# EAGLE design ModelPłytki (EAGLE 9.5.2)
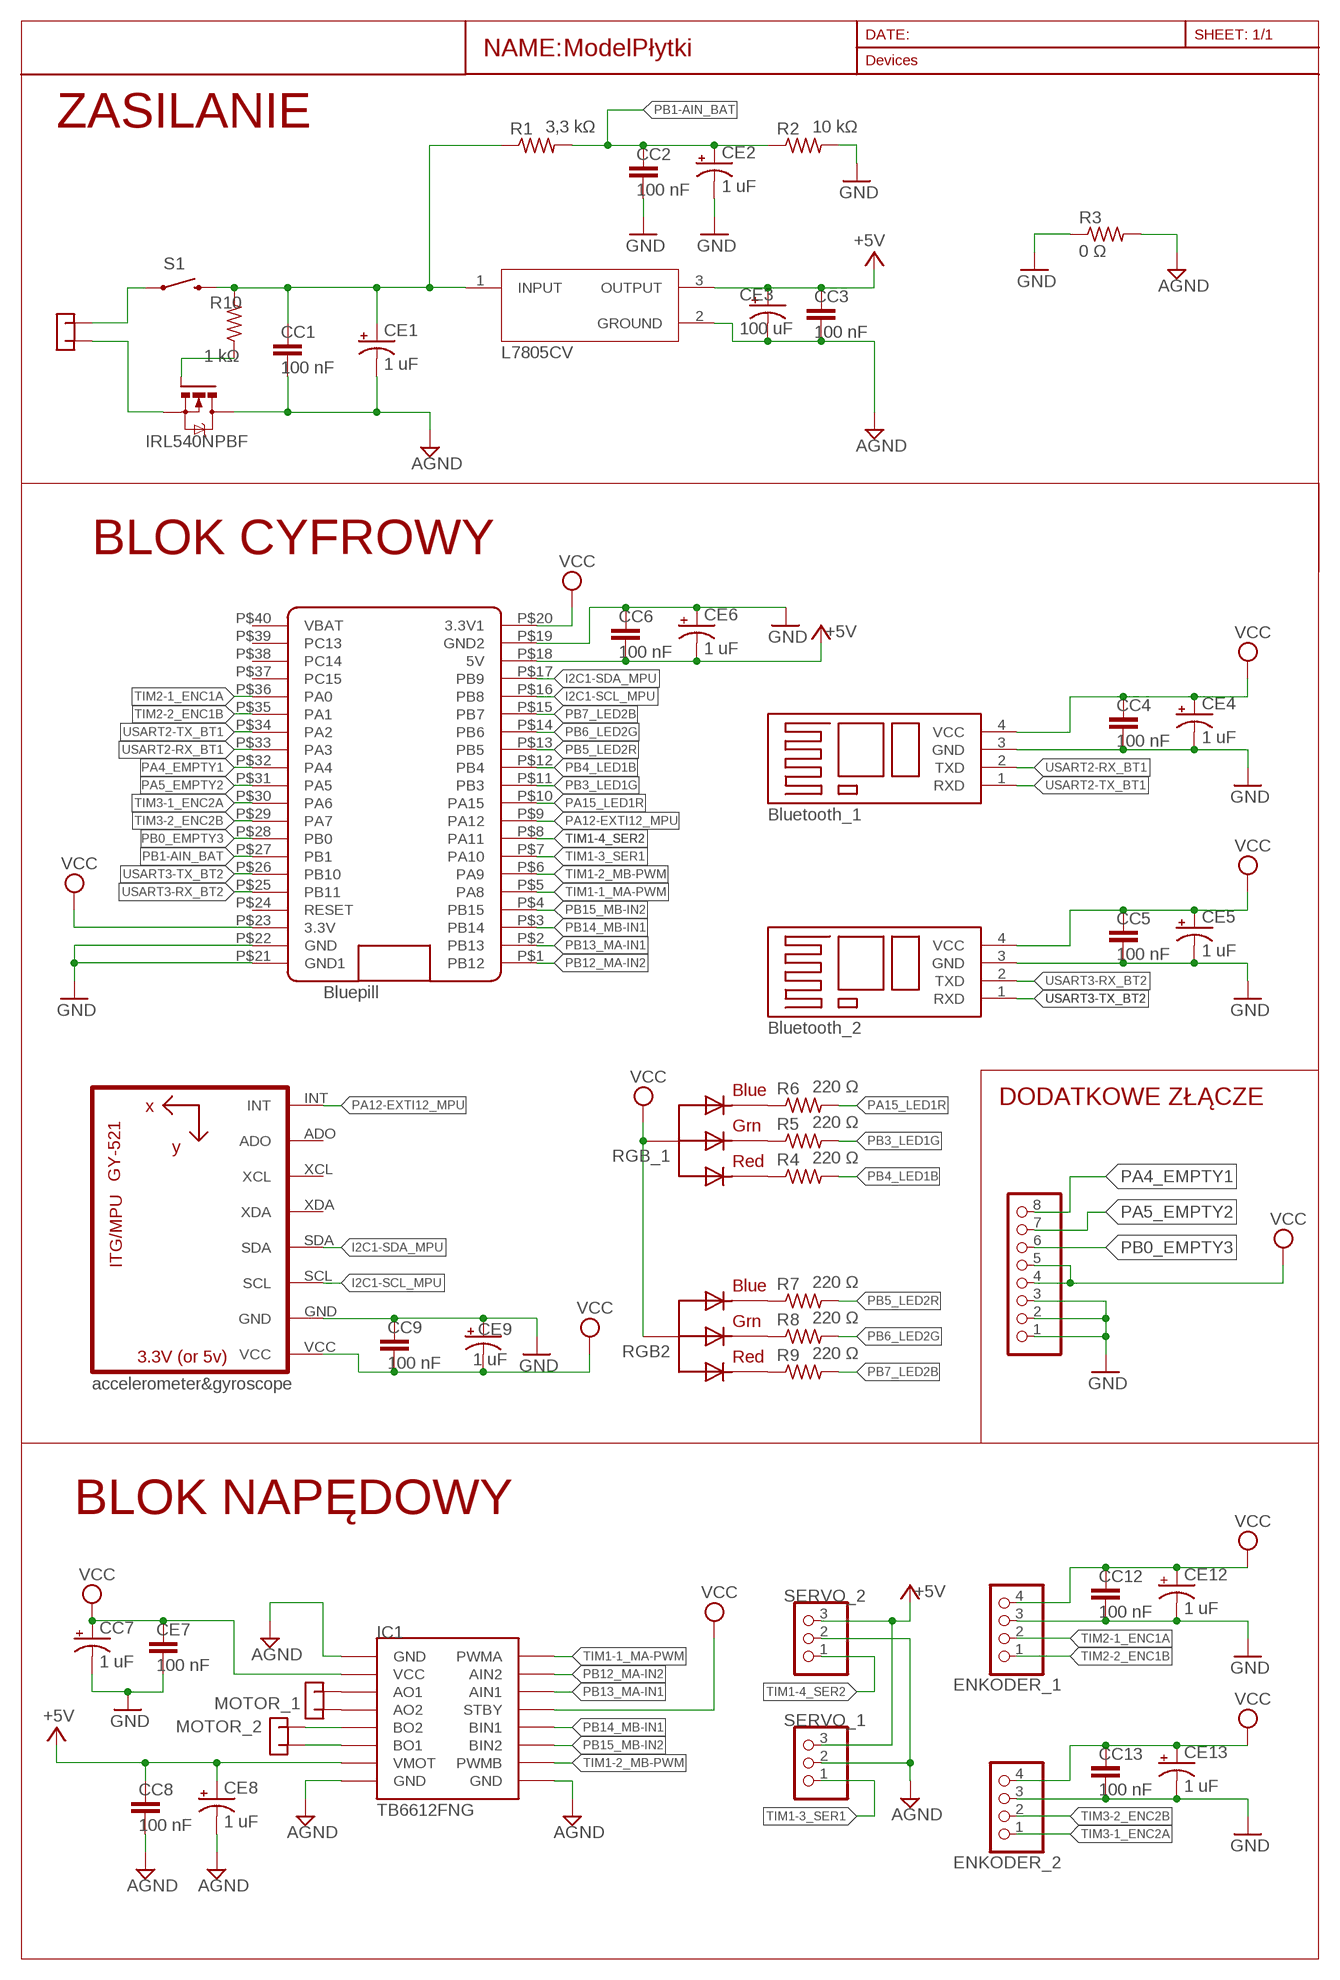
[diagram p0: schematic, sheet 1]

## Parts
BATERIA  -CON2  [CON2]
BLUETOOTH2  BLUETOOTH  [BLUETOOTH]
BLUETOOTH3  BLUETOOTH  [BLUETOOTH]
CC1  100 nF  C-EU025-030X050  [C025-030X050]
CC2  100 nF  C-EU025-030X050  [C025-030X050]
CC3  100 nF  C-EU025-030X050  [C025-030X050]
CC4  100 nF  C-EU025-030X050  [C025-030X050]
CC5  100 nF  C-EU025-030X050  [C025-030X050]
CC6  100 nF  C-EU025-030X050  [C025-030X050]
CC7  1 uF  CPOL-USTT2D5  [TT2D5]
CC8  100 nF  C-EU025-030X050  [C025-030X050]
CC9  100 nF  C-EU025-030X050  [C025-030X050]
CC12  100 nF  C-EU025-030X050  [C025-030X050]
CC13  100 nF  C-EU025-030X050  [C025-030X050]
CE1  1 uF  CPOL-USTT2D5  [TT2D5]
CE2  1 uF  CPOL-USTT2D5  [TT2D5]
CE3  100 uF  CPOL-USTT2D5  [TT2D5]
CE4  1 uF  CPOL-USTT2D5  [TT2D5]
CE5  1 uF  CPOL-USTT2D5  [TT2D5]
CE6  1 uF  CPOL-USTT2D5  [TT2D5]
CE7  100 nF  C-EU025-030X050  [C025-030X050]
CE8  1 uF  CPOL-USTT2D5  [TT2D5]
CE9  1 uF  CPOL-USTT2D5  [TT2D5]
CE12  1 uF  CPOL-USTT2D5  [TT2D5]
CE13  1 uF  CPOL-USTT2D5  [TT2D5]
ENKODER_1  PINHD-1X4  [1X04]
ENKODER_2  PINHD-1X4  [1X04]
IC1  MODUL_POLOLU  [MODUL_POLOLU]
IRL540NPBF  IRF520  [TO220BV]
JP4  PINHD-1X8BIG  [1X08-BIG]
MOTOR_1  -CON2  [CON2]
MOTOR_2  -CON2  [CON2]
R1  3,3 kΩ  R-US_0309/12  [0309/12]
R2  10 kΩ  R-US_0309/12  [0309/12]
R3  0 Ω  R-US_0309/12  [0309/12]
R4  220 Ω  R-US_0309/12  [0309/12]
R5  220 Ω  R-US_0309/12  [0309/12]
R6  220 Ω  R-US_0309/12  [0309/12]
R7  220 Ω  R-US_0309/12  [0309/12]
R8  220 Ω  R-US_0309/12  [0309/12]
R9  220 Ω  R-US_0309/12  [0309/12]
R10  1 kΩ  R-US_0309/12  [0309/12]
RGB2  RGBLED_CA-5MM  [LED5MMRGB]
RGB_1  RGBLED_CA-5MM  [LED5MMRGB]
S1  RS032G05A3SM-SPST-MOMENTARY-SWSMD-1101NE  [TACTILE-SWITCH-1101NE]
SERVO_1  PINHD-1X3  [1X03]
SERVO_2  PINHD-1X3  [1X03]
U2  L7805CV  [TO255P1040X460X1968-3]
U4  GY-521MPU6050  [GY-521]
U$2  BLUE_PILL  [BLUE_PILL]

## Nets
+5V: CC3.1 CC6.2 CC8.1 CE3.+ CE6.- CE8.+ IC1.VMOT SERVO_1.3 SERVO_2.3 U2.3(OUTPUT) U$2.P$18(5V)
AGND: CC1.2 CC3.2 CC8.2 CE1.- CE3.- CE8.- IC1.GND1(GND) IC1.GND2(GND) IC1.GND3(GND) IRL540NPBF.D R3.2 SERVO_1.2 SERVO_2.2 U2.2(GROUND)
GND: BLUETOOTH2.3(GND) BLUETOOTH3.3(GND) CC2.2 CC4.2 CC5.2 CC6.1 CC7.- CC9.1 CC12.2 CC13.2 CE2.- CE4.- CE5.- CE6.+ CE7.2 CE9.+ CE12.- CE13.- ENKODER_1.3 ENKODER_2.3 JP4.1 JP4.2 JP4.3 R2.2 R3.1 U4.GND U$2.P$19(GND2) U$2.P$21(GND1) U$2.P$22(GND)
I2C1-SCL_MPU: U4.SCL U$2.P$16(PB8)
I2C1-SDA_MPU: U4.SDA U$2.P$17(PB9)
N$2: IRL540NPBF.G R10.1
N$3: IC1.BO2 MOTOR_2.P$1
N$4: IC1.A02(AO2) MOTOR_1.P$2
N$5: IC1.BO1 MOTOR_2.P$2
N$8: BATERIA.P$1 S1.1
N$9: R6.1 RGB_1.4(BLUE)
N$10: R5.1 RGB_1.3(GREEN)
N$11: R4.1 RGB_1.1(RED)
N$13: R8.1 RGB2.3(GREEN)
N$14: R7.1 RGB2.4(BLUE)
N$15: R9.1 RGB2.1(RED)
N$16: BATERIA.P$2 IRL540NPBF.S
N$17: IC1.AO1 MOTOR_1.P$1
N$19: CC1.1 CE1.+ R1.1 R10.2 S1.2 U2.1(INPUT)
PA4_EMPTY1: JP4.8 U$2.P$32(PA4)
PA5_EMPTY2: JP4.7 U$2.P$31(PA5)
PA12-EXTI12_MPU: U4.INT U$2.P$9(PA12)
PA15_LED1R: R6.2 U$2.P$10(PA15)
PB0_EMPTY3: JP4.6 U$2.P$28(PB0)
PB1-AIN_BAT: CC2.1 CE2.+ R1.2 R2.1 U$2.P$27(PB1)
PB3_LED1G: R5.2 U$2.P$11(PB3)
PB4_LED1B: R4.2 U$2.P$12(PB4)
PB5_LED2R: R7.2 U$2.P$13(PB5)
PB6_LED2G: R8.2 U$2.P$14(PB6)
PB7_LED2B: R9.2 U$2.P$15(PB7)
PB12_MA-IN2: IC1.AIN2 U$2.P$1(PB12)
PB13_MA-IN1: IC1.AIN1 U$2.P$2(PB13)
PB14_MB-IN1: IC1.BIN1 U$2.P$3(PB14)
PB15_MB-IN2: IC1.BIN2 U$2.P$4(PB15)
TIM1-1_MA-PWM: IC1.PWMA U$2.P$5(PA8)
TIM1-2_MB-PWM: IC1.PWMB U$2.P$6(PA9)
TIM1-3_SER1: SERVO_1.1 U$2.P$7(PA10)
TIM1-4_SER2: SERVO_2.1 U$2.P$8(PA11)
TIM2-1_ENC1A: ENKODER_1.2 U$2.P$36(PA0)
TIM2-2_ENC1B: ENKODER_1.1 U$2.P$35(PA1)
TIM3-1_ENC2A: ENKODER_2.1 U$2.P$30(PA6)
TIM3-2_ENC2B: ENKODER_2.2 U$2.P$29(PA7)
USART2-RX_BT1: BLUETOOTH2.2(TXD) U$2.P$33(PA3)
USART2-TX_BT1: BLUETOOTH2.1(RXD) U$2.P$34(PA2)
USART3-RX_BT2: BLUETOOTH3.2(TXD) U$2.P$25(PB11)
USART3-TX_BT2: BLUETOOTH3.1(RXD) U$2.P$26(PB10)
VCC: BLUETOOTH2.4(VCC) BLUETOOTH3.4(VCC) CC4.1 CC5.1 CC7.+ CC9.2 CC12.1 CC13.1 CE4.+ CE5.+ CE7.1 CE9.- CE12.+ CE13.+ ENKODER_1.4 ENKODER_2.4 IC1.STBY IC1.VCC JP4.4 JP4.5 RGB2.2(VCC) RGB_1.2(VCC) U4.VCC U$2.P$20(3.3V1) U$2.P$23(3.3V)
Unconnected: U4.ADO U4.XCL U4.XDA U$2.P$24(RESET) U$2.P$37(PC15) U$2.P$38(PC14) U$2.P$39(PC13) U$2.P$40(VBAT)

## Notes on the sheet
- ZASILANIE
- BLOK CYFROWY
- Bluetooth_1
- Bluepill
- Bluetooth_2
- DODATKOWE ZŁĄCZE
- accelerometer&gyroscope
- BLOK NAPĘDOWY

## Library data of the parts
BATERIA = my_tango:-CON2
BLUETOOTH2 BLUETOOTH3 = my_Bluetooth:BLUETOOTH
CC1-CC6 CC8 CC9 CC12 CC13 CE7 = my_rcl:C-EU: CAPACITOR, European symbol; SPICEPREFIX: C
CC7 CE1-CE6 CE8 CE9 CE12 CE13 = my_rcl:CPOL-US: POLARIZED CAPACITOR, American symbol; SPICEPREFIX: C
ENKODER_1 ENKODER_2 = my_pinhead:PINHD-1X4: PIN HEADER
IC1 = my_TB6612FNG:MODUL_POLOLU
IRL540NPBF = transistor-power:IRF520: HEXFET Power MOSFET
JP4 = my_adafruit:PINHD-1X8: PIN HEADER
MOTOR_1 MOTOR_2 = motordc:-CON2
R1-R10 = my_rcl:R-US_: RESISTOR, American symbol; SPICEPREFIX: R
RGB2 RGB_1 = my_adafruit:RGBLED_CA: RGB LED, common-anode 5MM Staggered pins 5mm Piranha package http://www.ladyada.net/library/pcb/eaglelibrary.html
S1 = BeagleBone_Blue_R3:RS032G05A3SM-SPST-MOMENTARY-SW: 6x3.5mm 2-pin Momentary Switch (Push-button) Digikey Link <https://www.digikey.com/products/en?keywords=CKN10388TR-ND> Datasheet <https://media.digikey.com/pdf/Data%20Sheets/C&K/RS-032G05_-SM_RT.pdf>; PROD_ID: SWCH-00815
SERVO_1 SERVO_2 = my_pinhead:PINHD-1X3: PIN HEADER
U2 = my_L7805CV:L7805CV: Standard Regulator Pos 5V 1.5A 3-Pin(3+Tab) TO-220 Standard Regulator Pos 5V 1.5A 3-Pin(3+Tab) TO-220; AVAILABILITY: Unavailable; DESCRIPTION: Linear Voltage Regulator IC 1 Output 1.5A TO-220AB; MF: STMicroelectronics; MP: L7805CV; PACKAGE: TO-220 STMicroelectronics; PRICE: None
U4 = my_gy-521:GY-521
U$2 = my_BluePill:BLUE_PILL

## Board
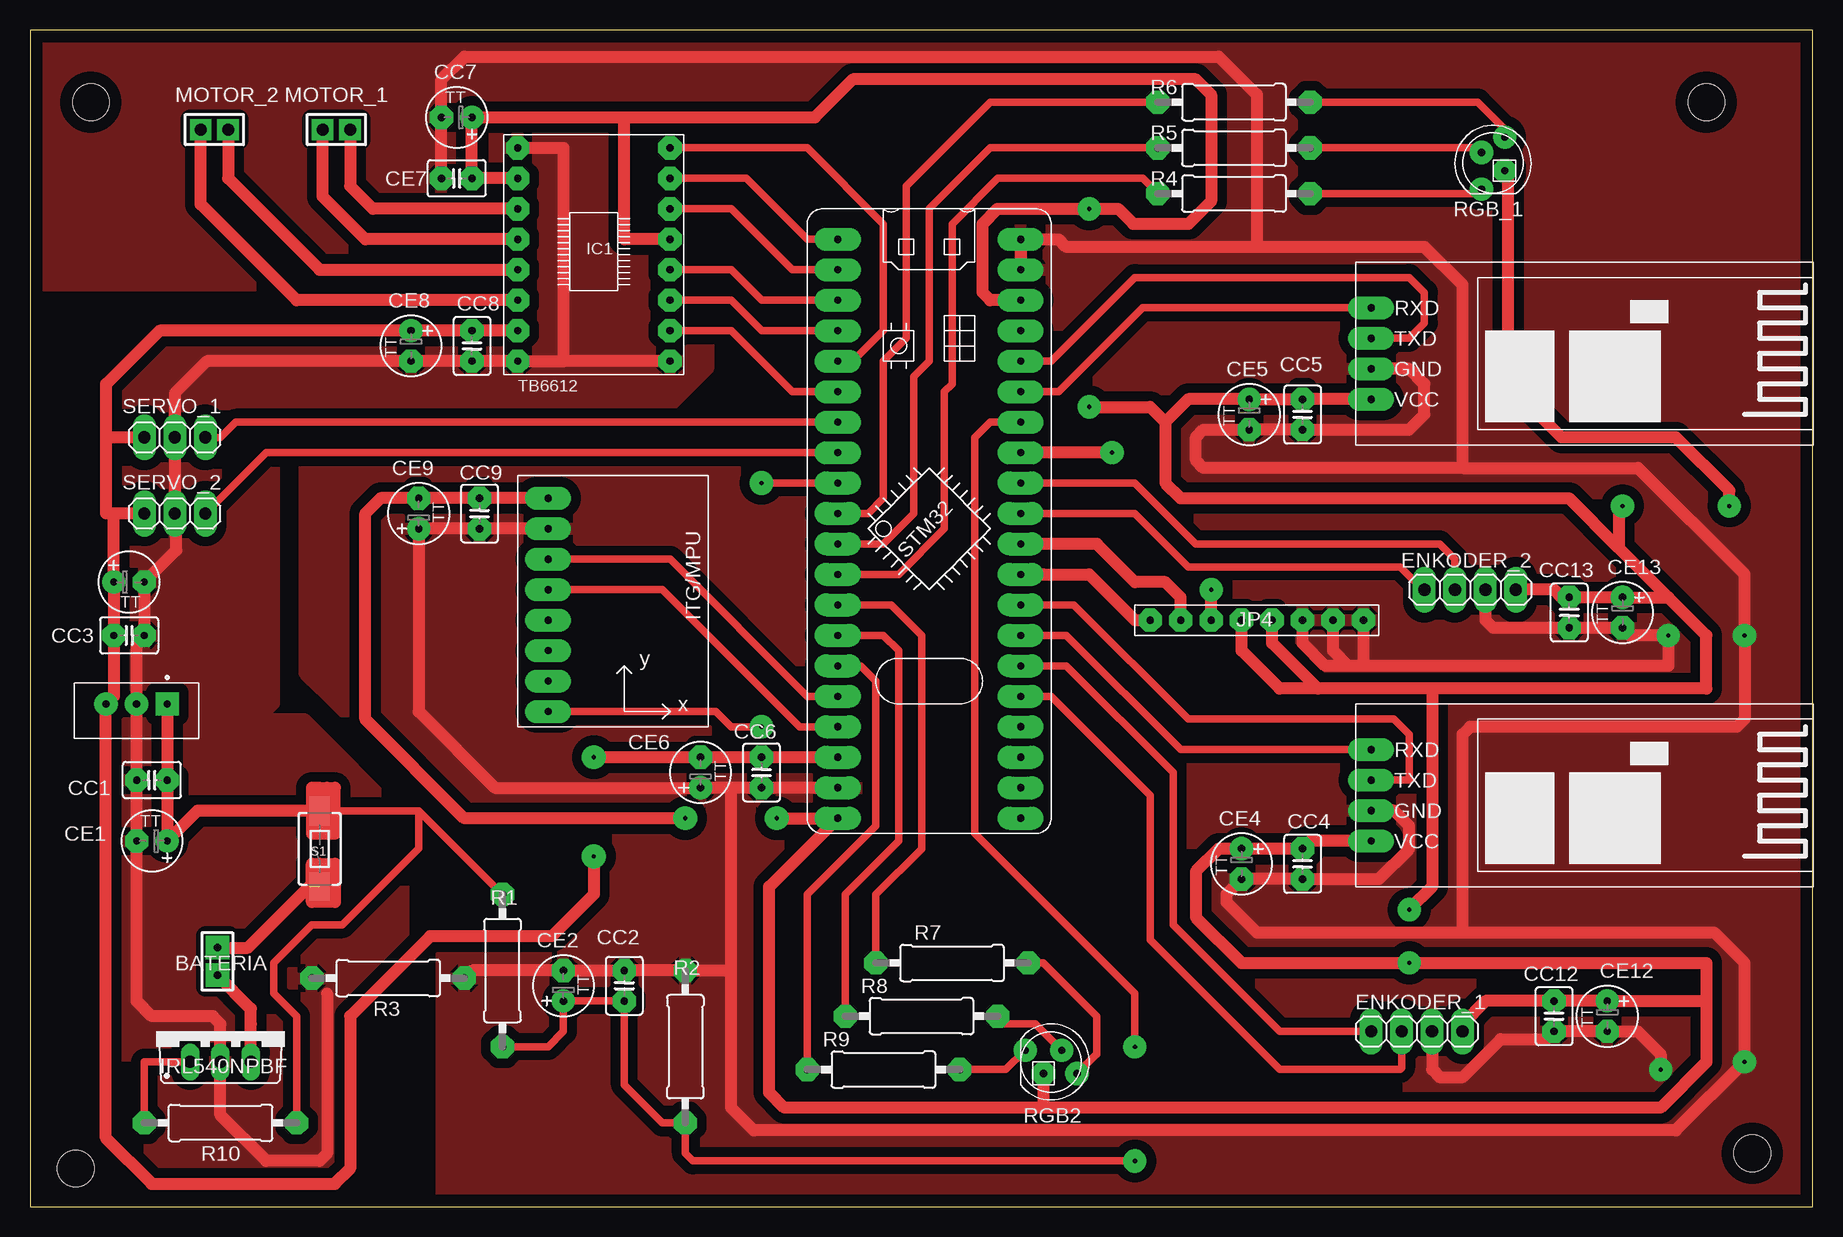
[diagram p1: board, top side]
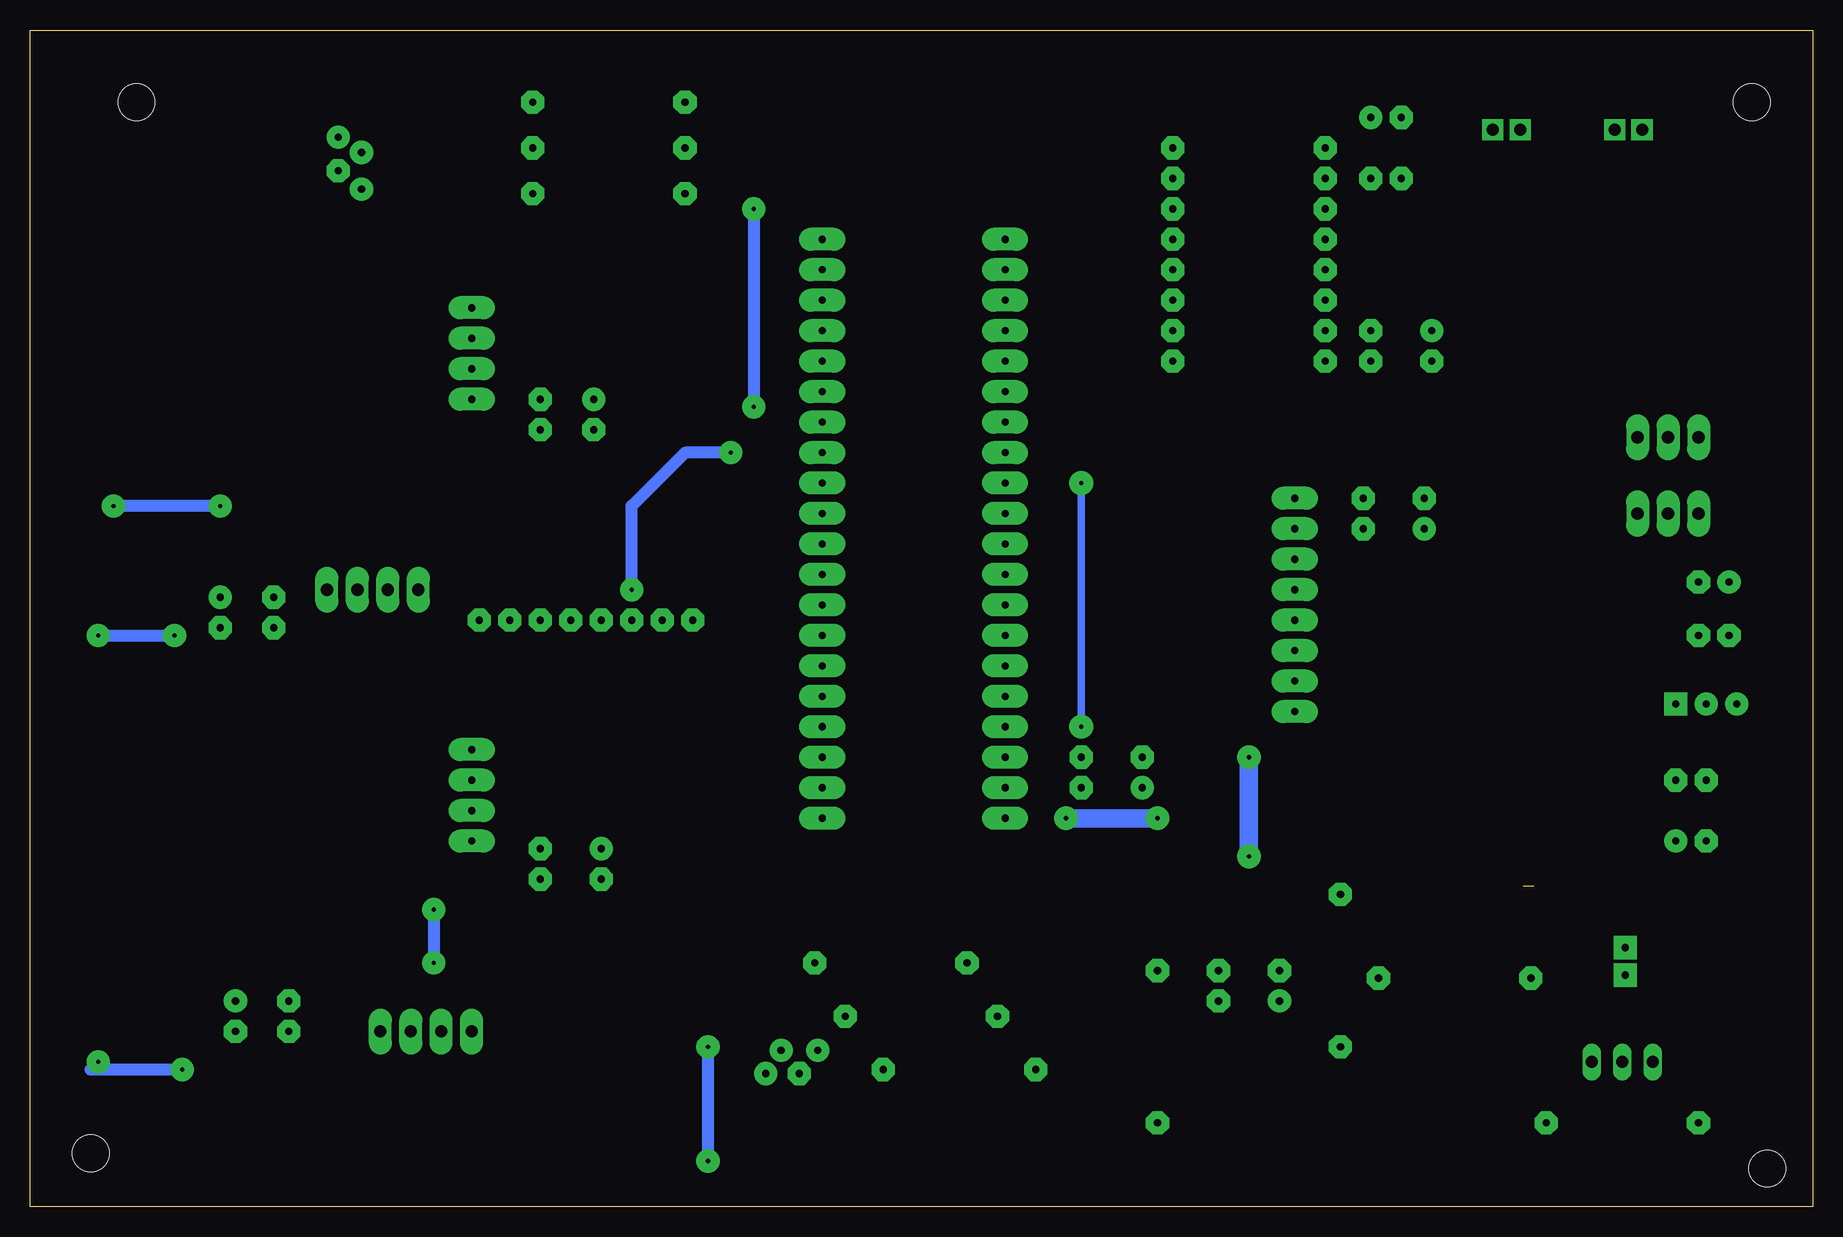
[diagram p2: board, bottom side, seen from below]

Size 148.57 x 98.09 mm. Coordinates in mm from the lower left corner, seen from the top.
Outline: 0,0 148.57,0 148.57,98.09 0,98.09 0,0
Copper layers (1*16): Top 0.035mm / dielectric 1.5mm / Bottom 0.035mm
Design rules "default": minimum track width 6mil, minimum drill 0.35mm, track to track 6mil, track to pad 6mil, pad to pad 6mil, via to via 6mil, smd to smd 6mil, copper to edge 40mil, drill to drill 6mil, minimum pad ring 10mil, minimum via ring 8mil, stop-mask expansion 4mil, vias tented up to drill 0mil, thermal gap 10mil
Holes 3.05 mm at 5.08,92.07 139.7,92.07 3.81,3.18 143.51,4.45

### Footprints (pad centres in the part's own frame; a part is rotated, then mirrored left to right if it is on the bottom)
CON2 = drill 0.6 pad 1.93 square: P$1 -1.27,-0.254; P$2 1.016,-0.254
BLUETOOTH = drill 0.6 pad 1.93 long: 1 -6.35,3.81; 2 -6.35,1.27; 3 -6.35,-1.27; 4 -6.35,-3.81
C025-030X050 = drill 0.6 pad 1.93 octagon: 1 -1.27,0; 2 1.27,0
TT2D5 = drill 0.6 pad 1.93: + -1.27,0 | drill 0.6 pad 1.93 octagon: - 1.27,0
1X04 = drill 1.016 pad 1.93 long: 1 -3.81,0; 2 -1.27,0; 3 1.27,0; 4 3.81,0
MODUL_POLOLU = drill 0.6 pad 1.93 octagon: A02 -6.35,1.27; AIN1 6.35,3.81; AIN2 6.35,6.35; AO1 -6.35,3.81; BIN1 6.35,-1.27; BIN2 6.35,-3.81; BO1 -6.35,-3.81; BO2 -6.35,-1.27; GND1 -6.35,8.89; GND2 -6.35,-8.89; GND3 6.35,-8.89; PWMA 6.35,8.89; PWMB 6.35,-6.35; STBY 6.35,1.27; VCC -6.35,6.35; VMOT -6.35,-6.35
TO220BV = drill 1.016 long: D 0,-2.54; G -2.54,-2.54; S 2.54,-2.54
1X08-BIG = drill 0.6 pad 1.93 octagon: 1 -8.89,0; 2 -6.35,0; 3 -3.81,0; 4 -1.27,0; 5 1.27,0; 6 3.81,0; 7 6.35,0; 8 8.89,0
CON2' = drill 1 pad 1.778 square: P$1 -1.27,-0.254; P$2 1.016,-0.254
0309/12 = drill 0.6 pad 1.93 octagon: 1 -6.35,0; 2 6.35,0
LED5MMRGB = drill 0.6 pad 1.93: 1 -2.159,0.968; 3 0.889,0.968; 4 2.159,-0.968 | drill 0.6 pad 1.93 octagon: 2 -0.635,-0.968
TACTILE-SWITCH-1101NE = smd 2.3 x 1.6: 1 -3.15,0; 2 3.15,0
1X03 = drill 1.016 pad 1.93 long: 1 -2.54,0; 2 0,0; 3 2.54,0
TO255P1040X460X1968-3 = drill 0.6 pad 1.93 square: 1 0,0 | drill 0.6 pad 1.93: 2 2.55,0; 3 5.1,0
GY-521 = drill 0.6 pad 1.93 long: ADO -8.89,-6.35; GND -8.89,6.35; INT -8.89,-8.89; SCL -8.89,3.81; SDA -8.89,1.27; VCC -8.89,8.89; XCL -8.89,-3.81; XDA -8.89,-1.27
BLUE_PILL = drill 0.6 pad 1.93 long: P$1 -7.62,15.24; P$2 -7.62,12.7; P$3 -7.62,10.16; P$4 -7.62,7.62; P$5 -7.62,5.08; P$6 -7.62,2.54; P$7 -7.62,0; P$8 -7.62,-2.54; P$9 -7.62,-5.08; P$10 -7.62,-7.62; P$11 -7.62,-10.16; P$12 -7.62,-12.7; P$13 -7.62,-15.24; P$14 -7.62,-17.78; P$15 -7.62,-20.32; P$16 -7.62,-22.86; P$17 -7.62,-25.4; P$18 -7.62,-27.94; P$19 -7.62,-30.48; P$20 -7.62,-33.02; P$21 7.62,15.24; P$22 7.62,12.7; P$23 7.62,10.16; P$24 7.62,7.62; P$25 7.62,5.08; P$26 7.62,2.54; P$27 7.62,0; P$28 7.62,-2.54; P$29 7.62,-5.08; P$30 7.62,-7.62; P$31 7.62,-10.16; P$32 7.62,-12.7; P$33 7.62,-15.24; P$34 7.62,-17.78; P$35 7.62,-20.32; P$36 7.62,-22.86; P$37 7.62,-25.4; P$38 7.62,-27.94; P$39 7.62,-30.48; P$40 7.62,-33.02

### Placement (x,y rotation side)
BATERIA  15.87,20.32 270 top
BLUETOOTH2  118.11,34.29 0 top
BLUETOOTH3  118.11,71.12 0 top
CC1  10.16,35.56 180 top
CC2  49.53,18.41 90 top
CC3  8.25,47.62 0 top
CC4  106.05,28.58 270 top
CC5  106.05,66.04 270 top
CC6  60.96,36.2 90 top
CC7  35.56,90.81 180 top
CC8  36.83,71.75 270 top
CC9  37.47,57.79 90 top
CC12  127,15.88 270 top
CC13  128.27,49.53 270 top
CE1  10.16,30.48 180 top
CE2  44.45,18.41 90 top
CE3  8.25,52.07 0 top
CE4  100.97,28.58 270 top
CE5  101.6,66.04 270 top
CE6  55.88,36.2 90 top
CE7  35.56,85.72 180 top
CE8  31.75,71.75 270 top
CE9  32.39,57.79 90 top
CE12  131.44,15.88 270 top
CE13  132.71,49.53 270 top
ENKODER_1  115.57,14.61 0 top
ENKODER_2  120.02,51.44 0 top
IC1  46.99,79.38 0 top
IRL540NPBF  15.87,14.61 0 top
JP4  102.23,48.9 180 top
MOTOR_1  -CON2  [CON2']  25.4,89.53 180 top
MOTOR_2  -CON2  [CON2']  15.24,89.53 180 top
R1  39.37,19.69 270 top
R2  54.61,13.34 90 top
R3  29.85,19.05 180 top
R4  100.33,84.46 180 top
R5  100.33,88.27 180 top
R6  100.33,92.07 180 top
R7  76.84,20.32 180 top
R8  74.3,15.88 180 top
R9  71.12,11.43 180 top
R10  15.87,6.99 0 top
RGB2  85.09,12.07 0 top
RGB_1  121.92,87 90 top
S1  24.13,29.85 90 top
SERVO_1  12.06,64.13 180 top
SERVO_2  12.06,57.79 180 top
U2  11.43,41.91 180 top
U4  52.07,50.16 0 top
U$2  74.93,65.41 0 top

### Tracks (layer width: path | path; a pad name or v marks a point on that pad's centre or on a via)
+5V  (via drill 0.35 pad 1.98)
  Top 1.016: IC1.VMOT CC8.1 CE8.+ 10.79,73.03 6.35,68.58 6.35,64.13 | 6.98,57.79 CE3.+ CC3.1 6.98,46.36 6.98,42.56 U2.3 6.33,5.72 10.14,1.91 25.4,1.91 26.67,3.18 26.67,15.88 33.34,22.54 43.5,22.54 46.99,26.04 v46.99,29.21 | 6.35,64.13 6.35,57.79 6.98,57.79 | SERVO_1.3 6.35,64.13 | SERVO_2.3 6.98,57.79 | U$2.P$18 CC6.2 CE6.- v46.99,37.47
  Bottom 1.524: v46.99,37.47 v46.99,29.21
AGND
  Top 1.016: IC1.GND1 44.45,88.27 44.45,70.48 | IC1.GND3 44.45,70.48 | 44.45,70.48 IC1.GND2 CC8.2 CE8.- 14.73,70.48 12.06,67.82 SERVO_1.2 SERVO_2.2 12.19,57.66 12.19,54.74 CE3.- CC3.2 8.88,46.98 U2.2 CC1.2 CE1.- 8.89,17.14 10.16,15.88 15.24,15.88 15.87,15.24 IRL540NPBF.D 15.87,7.62 19.68,3.81 24.13,3.81 24.76,4.45 24.76,17.78
  pour Top (isolate 0.813): 40,89.53 56.52,89.53 56.52,69.85 55.25,68.58 52.7,66.04 20.32,66.04 20.32,41.91 19.05,40.64 22.86,40.64 31.11,32.39 31.11,-1.9 29.85,-3.18 -6.99,-3.18 -12.07,1.91 -12.07,64.77 -2.54,74.3 -1.91,74.93 38.73,74.93 38.73,89.53
GND  (via drill 0.35 pad 1.93)
  Top 1.016: 102.23,80.01 102.23,92.71 99.06,95.88 36.19,95.88 34.29,93.98 CC7.- CE7.2 | 36.83,19.69 CE2.- CC2.2 R2.2 58.42,19.69 | 58.42,19.69 58.42,34.92 | U$2.P$22 U$2.P$21 85.73,80.65 86.36,80.01 102.23,80.01 | 119.38,61.59 97.79,61.59 97.16,62.23 97.16,64.13 97.79,64.77 CE5.- CC5.2 114.94,64.77 116.2,66.04 116.2,68.58 114.94,69.85 BLUETOOTH3.3 | 119.38,61.59 133.98,61.59 142.88,52.7 v142.88,47.62 142.88,40.64 142.24,40.01 120.02,40.01 119.38,39.37 119.38,22.86 | 119.38,61.59 119.38,76.84 116.2,80.01 102.23,80.01 | 111.13,45.09 136.52,45.09 v136.52,47.62 133.35,47.62 CE13.- CC13.2 121.92,48.26 121.29,48.9 ENKODER_2.3 | 109.86,45.09 108.59,46.36 JP4.2 | 111.13,45.09 109.86,45.09 | 109.86,45.09 107.95,45.09 106.05,46.99 JP4.3 | 111.13,45.09 JP4.1 | 119.38,22.86 102.23,22.86 99.7,25.4 99.7,26.04 CE4.- CC4.2 112.39,27.3 114.94,29.85 114.94,31.75 113.67,33.02 BLUETOOTH2.3 | 119.38,22.86 140.33,22.86 142.88,20.32 v142.88,12.07 137.16,6.35 60.33,6.35 58.42,8.26 58.42,19.69 | v135.89,11.43 135.89,12.7 133.98,14.61 CE12.- CC12.2 126.36,13.97 122.55,13.97 119.38,10.8 117.48,10.8 116.84,11.43 ENKODER_1.3 | U4.GND CC9.1 CE9.+ 32.39,41.28 38.73,34.92 CE6.+ 58.42,34.92 | U$2.P$19 CC6.1 58.42,34.92
  Bottom 1.016: v142.88,47.62 v136.52,47.62 | v142.88,12.07 143.51,11.43 v135.89,11.43
  pour Top (isolate 0.813): -3.81,76.84 34.29,76.84 35.56,78.1 37.47,80.01 37.47,91.44 38.1,92.07 57.15,92.07 60.33,88.9 60.33,84.46 60.33,68.58 55.25,63.5 54.61,62.87 22.86,62.87 22.86,44.45 24.13,43.18 36.19,31.12 36.83,31.12 34.29,28.58 34.29,-7.62 36.83,-5.08 167,-5.08 155.57,6.35 155.57,102.87 -2.54,102.87 -3.18,103.5 -3.18,77.47
I2C1-SCL_MPU
  Top 0.61: U4.SCL 53.34,53.98 64.77,42.55 U$2.P$16
I2C1-SDA_MPU
  Top 0.61: U$2.P$17 64.14,40.01 52.7,51.44 U4.SDA
N$2
  Top 0.61: IRL540NPBF.G 9.52,12.07 R10.1
N$3
  Top 1.016: IC1.BO2 24.13,78.1 16.51,85.72 MOTOR_2.P$1
N$4
  Top 1.016: MOTOR_1.P$2 24.38,84.2 27.94,80.65 IC1.A02
N$5
  Top 1.016: MOTOR_2.P$2 14.22,83.57 22.22,75.56 IC1.BO1
N$8  (1 unrouted)
  Top 1.016: 23.27,26.7 18.16,21.59 BATERIA.P$1 | 23.5,27.33 S1.1 24.13,27.94 24.45,27.62 24.76,27.94 24.13,28.58 | 23.5,27.33 23.5,28.58 24.13,28.58 | 24.13,28.58 25.4,28.58 25.4,25.4 23.5,25.4 23.5,27.33
N$9
  Top 0.61: RGB_1.4 122.89,89.84 120.65,92.07 R6.1
N$10
  Top 0.61: RGB_1.3 120.57,88.27 R5.1
N$11
  Top 0.61: RGB_1.1 120.57,84.46 R4.1
N$13
  Top 0.61: R8.1 81.28,15.24 83.77,15.24 RGB2.3
N$14
  Top 0.61: RGB2.4 88.85,12.7 88.9,12.7 88.9,15.88 84.45,20.32 R7.1
N$15
  Top 0.61: RGB2.1 81.33,11.43 R9.1
N$16
  Top 1.016: IRL540NPBF.S 18.42,15.24 18.42,16.51 BATERIA.P$2
N$17
  Top 1.016: IC1.AO1 28.57,83.19 26.67,85.09 MOTOR_1.P$1
N$19
  Top 0.61: R1.1 32.41,33 | 32.41,33 S1.2 | R10.2 22.22,15.88 20.32,17.78 20.32,20.32 23.5,23.5 26.04,23.5 32.41,29.87 32.41,33
  Top 1.016: U2.1 CC1.1 CE1.+ 13.94,33 S1.2 24.13,34.92 | 24.13,34.92 24.76,34.92 25.4,34.92 | 25.4,34.92 25.4,31.12 23.5,31.12 23.5,34.92 24.13,34.92 | 25.4,34.92 24.76,34.29 24.76,31.75 24.13,31.75
PA4_EMPTY1
  Top 1.016: 84.45,52.7 U$2.P$32 88.27,52.7 92.08,48.9 JP4.8
PA5_EMPTY2
  Top 1.016: U$2.P$31 88.9,55.24 92.08,52.07 94.62,52.07 95.89,50.8 JP4.7
PA12-EXTI12_MPU  (via drill 0.35 pad 1.98)
  Top 0.61: U4.INT 57.15,41.28 58.42,40.01 v60.96,40.01 | U$2.P$9 v60.96,60.33
  Bottom 0.61: v60.96,40.01 v60.96,60.33
PA15_LED1R
  Top 0.61: R6.2 80.01,92.07 73.03,85.09 73.03,72.39 71.12,70.48 71.12,59.05 69.85,57.79 U$2.P$10
PB0_EMPTY3  (via drill 0.35 pad 1.93)
  Top 1.016: JP4.6 v98.42,51.44 | v90.17,62.87 U$2.P$28
  Bottom 1.016: v98.42,51.44 98.42,58.42 93.98,62.87 v90.17,62.87
PB1-AIN_BAT  (via drill 0.35 pad 1.93)
  Top 0.61: U$2.P$27 80.01,65.41 78.74,64.13 78.74,31.12 92.08,17.78 v92.08,13.34 | R1.2 43.18,13.34 44.45,14.61 CE2.+ CC2.1 49.53,10.16 52.7,6.99 R2.1 54.61,4.45 55.25,3.81 v92.08,3.81
  Bottom 1.016: v92.08,13.34 v92.08,3.81
PB3_LED1G
  Top 0.61: U$2.P$11 71.12,55.24 73.66,57.79 73.66,69.22 74.93,70.48 74.93,83.19 80.01,88.27 R5.2
PB4_LED1B
  Top 0.61: U$2.P$12 72.39,52.7 76.2,56.52 76.2,67.94 76.84,68.58 76.84,81.91 80.64,85.72 92.71,85.72 R4.2
PB5_LED2R
  Top 0.61: R7.2 70.48,26.04 74.3,29.85 74.3,47.62 71.76,50.16 U$2.P$13
PB6_LED2G
  Top 0.61: U$2.P$14 71.12,47.62 72.39,46.36 72.39,30.48 67.95,26.04 R8.2
PB7_LED2B
  Top 0.61: U$2.P$15 69.22,45.09 70.48,43.81 70.48,31.75 64.77,26.04 R9.2
PB12_MA-IN2
  Top 0.61: IC1.AIN2 59.69,85.72 64.77,80.65 U$2.P$1
PB13_MA-IN1
  Top 0.61: IC1.AIN1 58.42,83.19 63.5,78.1 U$2.P$2
PB14_MB-IN1
  Top 0.61: IC1.BIN1 58.42,78.1 60.96,75.56 U$2.P$3
PB15_MB-IN2
  Top 0.61: U$2.P$4 60.96,73.03 58.42,75.56 IC1.BIN2
TIM1-1_MA-PWM
  Top 0.61: U$2.P$5 68.58,70.48 71.12,73.03 71.12,81.91 64.77,88.27 IC1.PWMA
TIM1-2_MB-PWM
  Top 0.61: U$2.P$6 63.5,67.94 58.42,73.03 IC1.PWMB
TIM1-3_SER1
  Top 0.61: U$2.P$7 17.14,65.41 15.87,64.13 SERVO_1.1
TIM1-4_SER2
  Top 0.61: 66.04,62.87 U$2.P$8 19.68,62.87 SERVO_2.1
TIM2-1_ENC1A
  Top 0.61: U$2.P$36 85.09,42.55 93.34,34.29 93.34,22.23 104.14,11.43 114.17,11.43 114.3,11.56 ENKODER_1.2
TIM2-2_ENC1B
  Top 0.61: U$2.P$35 86.36,45.09 95.25,36.2 95.25,23.5 104.14,14.61 ENKODER_1.1
TIM3-1_ENC2A
  Top 0.61: U$2.P$30 92.08,57.79 96.52,53.34 114.17,53.34 116.08,51.44 ENKODER_2.1
TIM3-2_ENC2B
  Top 0.61: U$2.P$29 92.08,60.33 97.16,55.24 117.48,55.24 118.74,53.98 ENKODER_2.2
USART2-RX_BT1
  Top 0.61: U$2.P$33 87,50.16 96.52,40.64 113.67,40.64 114.94,39.37 114.94,35.56 BLUETOOTH2.2
USART2-TX_BT1
  Top 0.61: U$2.P$34 86.36,47.62 95.89,38.1 BLUETOOTH2.1
USART3-RX_BT2
  Top 0.61: U$2.P$25 85.09,70.48 92.08,77.47 114.94,77.47 116.2,76.2 116.2,73.66 114.94,72.39 BLUETOOTH3.2
USART3-TX_BT2
  Top 0.61: BLUETOOTH3.1 92.71,74.93 85.73,67.94 U$2.P$26
VCC  (via drill 0.35 pad 1.93, 0.35 pad 1.98)
  Top 1.016: IC1.VCC CE7.1 CC7.+ 49.53,90.81 | 49.53,90.81 65.41,90.81 68.58,93.98 97.16,93.98 98.42,92.71 98.42,83.82 96.55,81.94 91.93,81.94 90.69,83.19 v88.27,83.19 80.64,83.19 79.38,81.91 79.38,76.2 80.01,75.56 U$2.P$23 | IC1.STBY 49.53,80.65 49.53,90.81 | v54.61,32.39 36.19,32.39 27.94,40.64 27.94,57.79 29.21,59.05 CE9.- CC9.2 U4.VCC | v62.23,32.39 U$2.P$20 61.59,26.67 61.59,9.53 62.87,8.26 84.45,8.26 | 84.45,8.26 135.89,8.26 139.7,12.07 139.7,17.14 | RGB_1.2 123.19,86.36 123.19,68.58 127.64,64.13 137.16,64.13 141.6,59.69 v141.6,58.42 | BLUETOOTH3.4 CC5.1 CE5.+ 96.52,67.31 94.62,65.41 | 136.52,50.8 139.7,47.62 139.7,43.18 116.84,43.18 | 136.52,50.8 132.4,54.93 | 132.4,54.93 128.27,59.05 95.89,59.05 94.62,60.33 94.62,65.41 | v132.71,58.42 132.4,58.1 132.4,54.93 | 136.52,50.8 CE13.+ CC13.1 127.64,50.8 127,51.44 ENKODER_2.4 | 116.84,43.18 107.31,43.18 | JP4.4 103.51,46.99 107.31,43.18 | 107.31,43.18 104.14,43.18 100.97,46.36 JP4.5 | BLUETOOTH2.4 106.68,30.48 CC4.1 CE4.+ 99.06,29.85 97.16,27.94 97.16,24.13 100.97,20.32 v114.94,20.32 139.7,20.32 139.7,17.14 | 116.84,43.18 116.84,26.67 v114.94,24.77 | v88.27,66.68 93.34,66.68 94.62,65.41 | 139.7,17.14 CE12.+ CC12.1 121.29,17.14 119.38,15.24 ENKODER_1.4 | RGB2.2 84.45,8.26
  Bottom 1.016: v132.71,58.42 v141.6,58.42 | v114.94,24.77 v114.94,20.32 | v88.27,83.19 v88.27,66.68
  Bottom 1.524: v62.23,32.39 v54.61,32.39